# Altium schematic sheet Floppytron.SchDoc
size A4
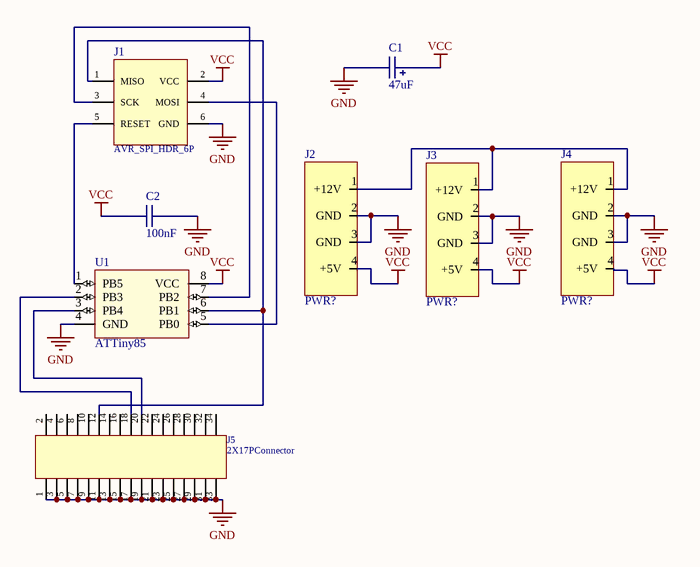
[diagram p0: Floppytron.SchDoc]

## Parts
C1  47uF  [CAPPR20D05H11]
C2  100nF  [CAPAR500W50L730T250H650]
J1  AVR_SPI_HDR_6P  [HEADER_3x2]
J2  PWR?  [MOLEX_4-PIN_DISK_PWR_MALE_PCB]
J3  PWR?  [MOLEX_4-PIN_DISK_PWR_MALE_PCB]
J4  PWR?  [MOLEX_4-PIN_DISK_PWR_MALE_PCB]
J5  2X17PConnector  [HDRV34W64P254_2X17_5070X900X900B]
U1  ATTiny85  [DIP8]

## Nets
GND: C1.1 C2.2 J1.6(GND) J2.2(GND) J2.3(GND) J3.2(GND) J3.3(GND) J4.2(GND) J4.3(GND) J5.1 J5.3 J5.5 J5.7 J5.9 J5.11 J5.13 J5.15 J5.17 J5.19 J5.21 J5.23 J5.25 J5.27 J5.29 J5.31 J5.33 U1.4(GND)
VCC: C1.2 C2.1 J1.2(VCC) J2.4(+5V) J3.4(+5V) J4.4(+5V) U1.8(VCC)
NetJ1_1: J1.1(MISO) J5.12 U1.6(PB1)
NetJ1_3: J1.3(SCK) U1.7(PB2)
NetJ1_4: J1.4(MOSI) U1.5(PB0)
NetJ1_5: J1.5(RESET) U1.1(PB5)
NetJ2_1: J2.1(+12V) J3.1(+12V) J4.1(+12V)
NetJ5_18: J5.18 U1.2(PB3)
NetJ5_20: J5.20 U1.3(PB4)

Not connected (* = marked no-connect by the designer): J5 2 4 6 8 10 14 16 22 24 26 28 30 32 34

## Library data of the parts
C1 = 3296: 25V, Elektrolytt; id: 3296; rad: 9; rom: OV; lager_type: Fremlager; dybde: 2; hylle: 3; antall: 8; pakke_opprettet_av: 1335; pakke_opprettet: 13.11.2016 14.55.27; symbol_opprettet_av: 815; symbol_opprettet: 28.06.2014 15.26.13; leverandor_varenr: 9451072; pris: 1; nokkelord: Kondensator, capacitor, Elektrolytt; leverandor: Farnell; pakketype: TH; kolonne: 2; navn: 47uF
C2 = 3269: 100V plast; id: 3269; rad: 7; rom: OV; lager_type: Fremlager; dybde: 0; hylle: 3; antall: 400; kolonne: 1; pakke_opprettet_av: 1335; pakke_opprettet: 16.11.2016 21.11.30; symbol_opprettet_av: 815; symbol_opprettet: 14.11.2014 20.19.34; leverandor_varenr: 2525325; pris: 2; leverandor: Farnell; pakketype: TH; navn: 100nF
J1 = 3052: 6-pins ISP header for AVR; id: 3052; pakke_opprettet_av: 774; pakke_opprettet: 23.08.2014 13.37.50; symbol_opprettet_av: 924; symbol_opprettet: 24.05.2015 01.27.07; pris: 6; nokkelord: Programming, SPI; pakketype: TH; navn: AVR_SPI_HDR
J2-J4 = 2330: 4Pin PC power connector; id: 2330; pakke_opprettet_av: 924; pakke_opprettet: 15.06.2014 14.32.42; symbol_opprettet: 15.06.2014 13.38.38; navn: 4P Molex; pris: 0; produsent: Molex; pakketype: TH; symbol_opprettet_av: 924
J5 = 2390: id: 2390; pakke_opprettet_av: 815; pakke_opprettet: 12.07.2014 17.05.20; symbol_opprettet: 12.07.2014 17.03.56; beskrivelse: Header; leverandor_varenr: 2215313; navn: Header Shrouded 2X17P; pris: 10; nokkelord: IDE; produsent: Amphenol; leverandor: Farnell; pakketype: TH; symbol_opprettet_av: 815